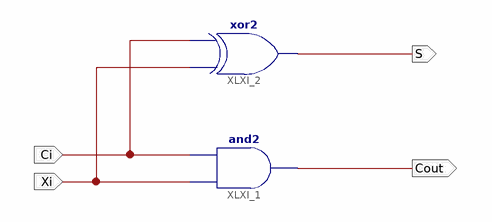
[diagram p0: schematic sheet 1]
// Xilinx ISE schematic ha_sch.sch (spartan3e) as structural Verilog: 2 symbols, 4 ports
module ha_sch (
  input  Xi,
  input  Ci,
  output Cout,
  output S
);

  and XLXI_1 (Cout, Xi, Ci);
  xor XLXI_2 (S, Xi, Ci);
endmodule
